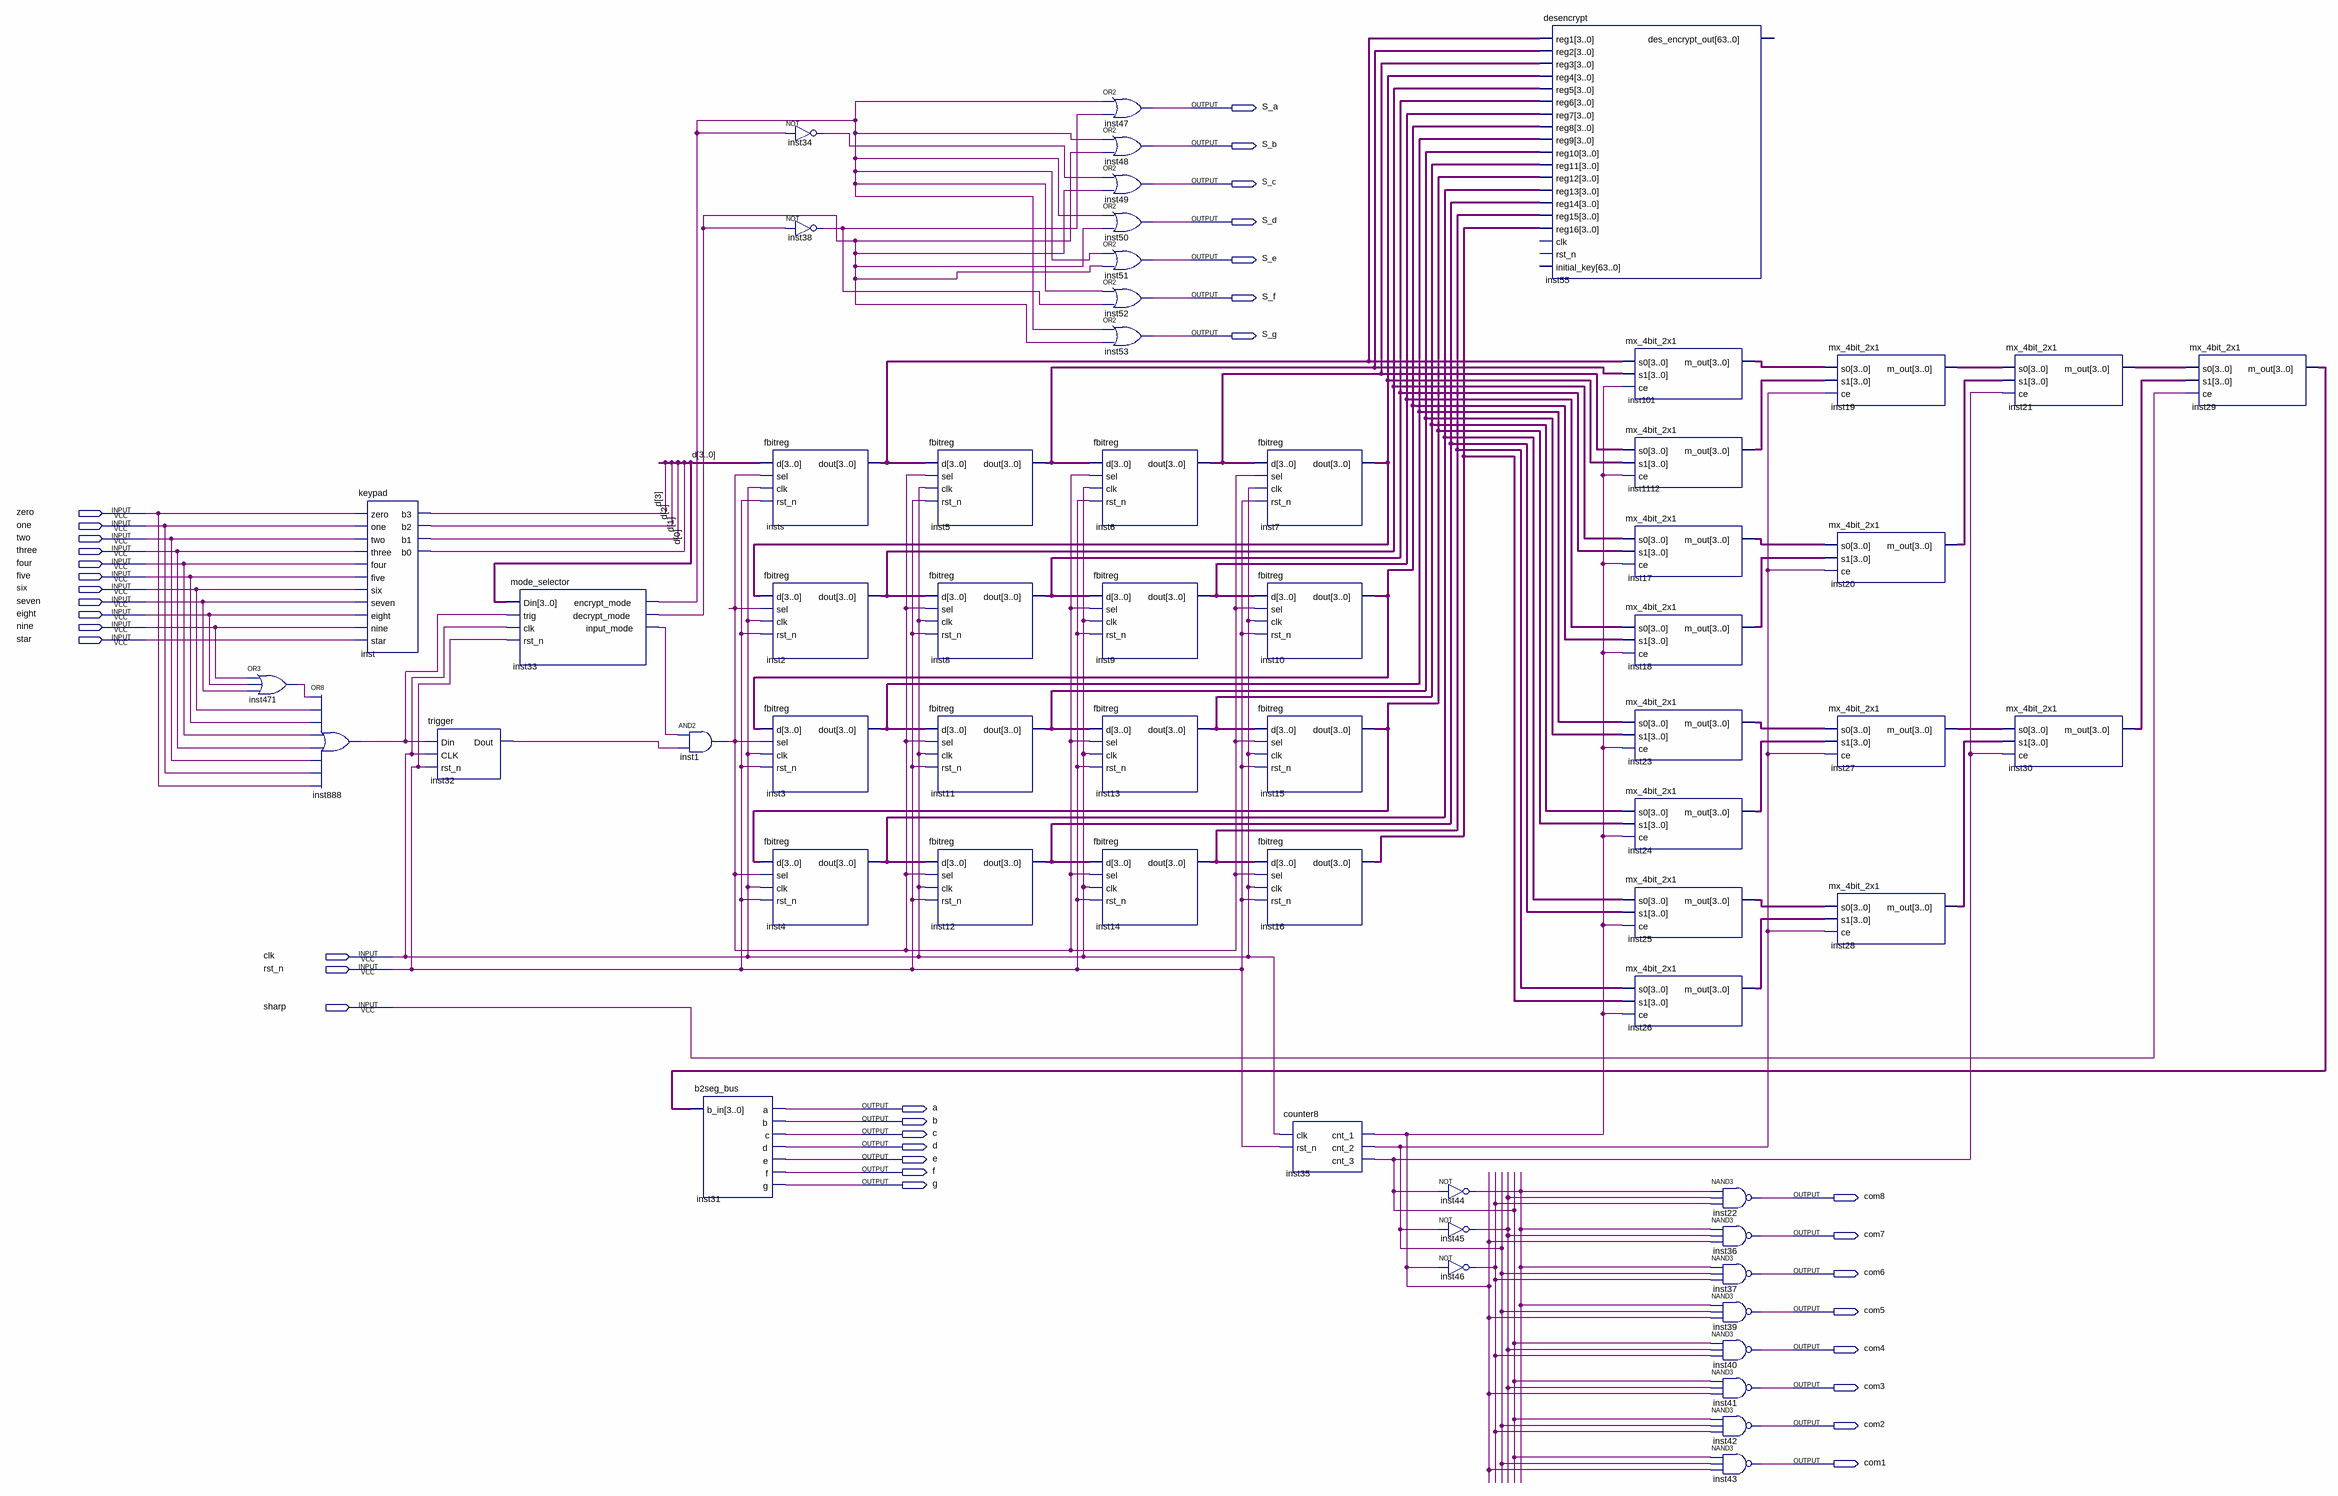
[diagram p0: schematic sheet]
// Quartus schematic main.bdf as structural Verilog: 60 symbols, 36 pins
module main (
  input  zero,
  input  one,
  input  two,
  input  three,
  input  four,
  input  five,
  input  six,
  input  seven,
  input  eight,
  input  nine,
  input  star,
  input  clk,
  input  rst_n,
  input  sharp,
  output S_a,
  output S_b,
  output S_c,
  output S_d,
  output S_e,
  output S_f,
  output S_g,
  output a,
  output b,
  output c,
  output d,
  output e,
  output f,
  output g,
  output com8,
  output com7,
  output com6,
  output com5,
  output com4,
  output com3,
  output com2,
  output com1
);

  wire inst1_out, inst32_dout, inst33_decrypt_mode, inst33_encrypt_mode, inst33_input_mode, inst34_out,
       inst35_cnt_1, inst35_cnt_2, inst35_cnt_3, inst38_out, inst44_out, inst45_out, inst46_out, inst471_out,
       inst888_out;
  wire [3:0] d_bus, inst2_dout, inst3_dout, inst4_dout, inst5_dout, inst6_dout, inst7_dout, inst8_dout,
       inst9_dout, inst10_dout, inst11_dout, inst12_dout, inst13_dout, inst14_dout, inst15_dout, inst16_dout,
       inst17_m_out, inst18_m_out, inst19_m_out, inst20_m_out, inst21_m_out, inst23_m_out, inst24_m_out,
       inst25_m_out, inst26_m_out, inst27_m_out, inst28_m_out, inst29_m_out, inst30_m_out, inst101_m_out,
       inst1112_m_out, insts_dout;

  or inst471 (inst471_out, nine, eight, seven);
  or inst888 (inst888_out, inst471_out, six, five, four, three, two, one, zero);
  keypad inst (
    .zero(zero), .one(one), .two(two), .three(three), .four(four), .five(five), .six(six), .seven(seven),
    .eight(eight), .nine(nine), .star(star), .b3(d_bus[3]), .b2(d_bus[2]), .b1(d_bus[1]), .b0(d_bus[0]));
  trigger inst32 (.Din(inst888_out), .CLK(clk), .rst_n(rst_n), .Dout(inst32_dout));
  mode_selector inst33 (
    .Din(d_bus), .trig(inst888_out), .clk(clk), .rst_n(rst_n), .encrypt_mode(inst33_encrypt_mode),
    .decrypt_mode(inst33_decrypt_mode), .input_mode(inst33_input_mode));
  and inst1 (inst1_out, inst33_input_mode, inst32_dout);
  b2seg_bus inst31 (.b_in(inst29_m_out), .a(a), .b(b), .c(c), .d(d), .e(e), .f(f), .g(g));
  fbitreg insts (.d(d_bus), .sel(inst1_out), .clk(clk), .rst_n(rst_n), .dout(insts_dout));
  fbitreg inst2 (.d(inst7_dout), .sel(inst1_out), .clk(clk), .rst_n(rst_n), .dout(inst2_dout));
  fbitreg inst3 (.d(inst10_dout), .sel(inst1_out), .clk(clk), .rst_n(rst_n), .dout(inst3_dout));
  fbitreg inst4 (.d(inst15_dout), .sel(inst1_out), .clk(clk), .rst_n(rst_n), .dout(inst4_dout));
  not inst34 (inst34_out, inst33_encrypt_mode);
  not inst38 (inst38_out, inst33_decrypt_mode);
  fbitreg inst5 (.d(insts_dout), .sel(inst1_out), .clk(clk), .rst_n(rst_n), .dout(inst5_dout));
  fbitreg inst8 (.d(inst2_dout), .sel(inst1_out), .clk(clk), .rst_n(rst_n), .dout(inst8_dout));
  fbitreg inst11 (.d(inst3_dout), .sel(inst1_out), .clk(clk), .rst_n(rst_n), .dout(inst11_dout));
  fbitreg inst12 (.d(inst4_dout), .sel(inst1_out), .clk(clk), .rst_n(rst_n), .dout(inst12_dout));
  or inst47 (S_a, inst33_encrypt_mode, inst38_out);
  or inst48 (S_b, inst33_encrypt_mode, inst33_decrypt_mode);
  or inst49 (S_c, inst34_out, inst33_decrypt_mode);
  or inst50 (S_d, inst33_encrypt_mode, inst33_decrypt_mode);
  or inst51 (S_e, inst33_encrypt_mode, inst33_decrypt_mode);
  or inst52 (S_f, inst33_encrypt_mode, inst38_out);
  or inst53 (S_g, inst33_encrypt_mode, inst33_decrypt_mode);
  fbitreg inst6 (.d(inst5_dout), .sel(inst1_out), .clk(clk), .rst_n(rst_n), .dout(inst6_dout));
  fbitreg inst9 (.d(inst8_dout), .sel(inst1_out), .clk(clk), .rst_n(rst_n), .dout(inst9_dout));
  fbitreg inst13 (.d(inst11_dout), .sel(inst1_out), .clk(clk), .rst_n(rst_n), .dout(inst13_dout));
  fbitreg inst14 (.d(inst12_dout), .sel(inst1_out), .clk(clk), .rst_n(rst_n), .dout(inst14_dout));
  fbitreg inst7 (.d(inst6_dout), .sel(inst1_out), .clk(clk), .rst_n(rst_n), .dout(inst7_dout));
  fbitreg inst10 (.d(inst9_dout), .sel(inst1_out), .clk(clk), .rst_n(rst_n), .dout(inst10_dout));
  fbitreg inst15 (.d(inst13_dout), .sel(inst1_out), .clk(clk), .rst_n(rst_n), .dout(inst15_dout));
  fbitreg inst16 (.d(inst14_dout), .sel(inst1_out), .clk(clk), .rst_n(rst_n), .dout(inst16_dout));
  counter8 inst35 (.clk(clk), .rst_n(rst_n), .cnt_1(inst35_cnt_1), .cnt_2(inst35_cnt_2), .cnt_3(inst35_cnt_3));
  not inst44 (inst44_out, inst35_cnt_3);
  not inst45 (inst45_out, inst35_cnt_2);
  not inst46 (inst46_out, inst35_cnt_1);
  desencrypt inst55 (
    .reg1(insts_dout), .reg2(inst5_dout), .reg3(inst6_dout), .reg4(inst7_dout), .reg5(inst2_dout),
    .reg6(inst8_dout), .reg7(inst9_dout), .reg8(inst10_dout), .reg9(inst3_dout), .reg10(inst11_dout),
    .reg11(inst13_dout), .reg12(inst15_dout), .reg13(inst4_dout), .reg14(inst12_dout), .reg15(inst14_dout),
    .reg16(inst16_dout));  // open: clk, rst_n, initial_key, des_encrypt_out
  mx_4bit_2x1 inst101 (.s0(insts_dout), .s1(inst5_dout), .ce(inst35_cnt_1), .m_out(inst101_m_out));
  mx_4bit_2x1 inst1112 (.s0(inst6_dout), .s1(inst7_dout), .ce(inst35_cnt_1), .m_out(inst1112_m_out));
  mx_4bit_2x1 inst17 (.s0(inst2_dout), .s1(inst8_dout), .ce(inst35_cnt_1), .m_out(inst17_m_out));
  mx_4bit_2x1 inst18 (.s0(inst9_dout), .s1(inst10_dout), .ce(inst35_cnt_1), .m_out(inst18_m_out));
  mx_4bit_2x1 inst23 (.s0(inst3_dout), .s1(inst11_dout), .ce(inst35_cnt_1), .m_out(inst23_m_out));
  mx_4bit_2x1 inst24 (.s0(inst13_dout), .s1(inst15_dout), .ce(inst35_cnt_1), .m_out(inst24_m_out));
  mx_4bit_2x1 inst25 (.s0(inst4_dout), .s1(inst12_dout), .ce(inst35_cnt_1), .m_out(inst25_m_out));
  mx_4bit_2x1 inst26 (.s0(inst14_dout), .s1(inst16_dout), .ce(inst35_cnt_1), .m_out(inst26_m_out));
  nand inst22 (com8, inst44_out, inst45_out, inst46_out);
  nand inst36 (com7, inst44_out, inst45_out, inst35_cnt_1);
  nand inst37 (com6, inst44_out, inst35_cnt_2, inst46_out);
  nand inst39 (com5, inst44_out, inst35_cnt_2, inst35_cnt_1);
  nand inst40 (com4, inst35_cnt_3, inst45_out, inst46_out);
  nand inst41 (com3, inst35_cnt_3, inst45_out, inst35_cnt_1);
  nand inst42 (com2, inst35_cnt_3, inst35_cnt_2, inst46_out);
  nand inst43 (com1, inst35_cnt_3, inst35_cnt_2, inst35_cnt_1);
  mx_4bit_2x1 inst19 (.s0(inst101_m_out), .s1(inst1112_m_out), .ce(inst35_cnt_2), .m_out(inst19_m_out));
  mx_4bit_2x1 inst20 (.s0(inst17_m_out), .s1(inst18_m_out), .ce(inst35_cnt_2), .m_out(inst20_m_out));
  mx_4bit_2x1 inst27 (.s0(inst23_m_out), .s1(inst24_m_out), .ce(inst35_cnt_2), .m_out(inst27_m_out));
  mx_4bit_2x1 inst28 (.s0(inst25_m_out), .s1(inst26_m_out), .ce(inst35_cnt_2), .m_out(inst28_m_out));
  mx_4bit_2x1 inst21 (.s0(inst19_m_out), .s1(inst20_m_out), .ce(inst35_cnt_3), .m_out(inst21_m_out));
  mx_4bit_2x1 inst30 (.s0(inst27_m_out), .s1(inst28_m_out), .ce(inst35_cnt_3), .m_out(inst30_m_out));
  mx_4bit_2x1 inst29 (.s0(inst21_m_out), .s1(inst30_m_out), .ce(sharp), .m_out(inst29_m_out));
endmodule
